# EAGLE design ControlBoardMain (EAGLE 8.1.0)
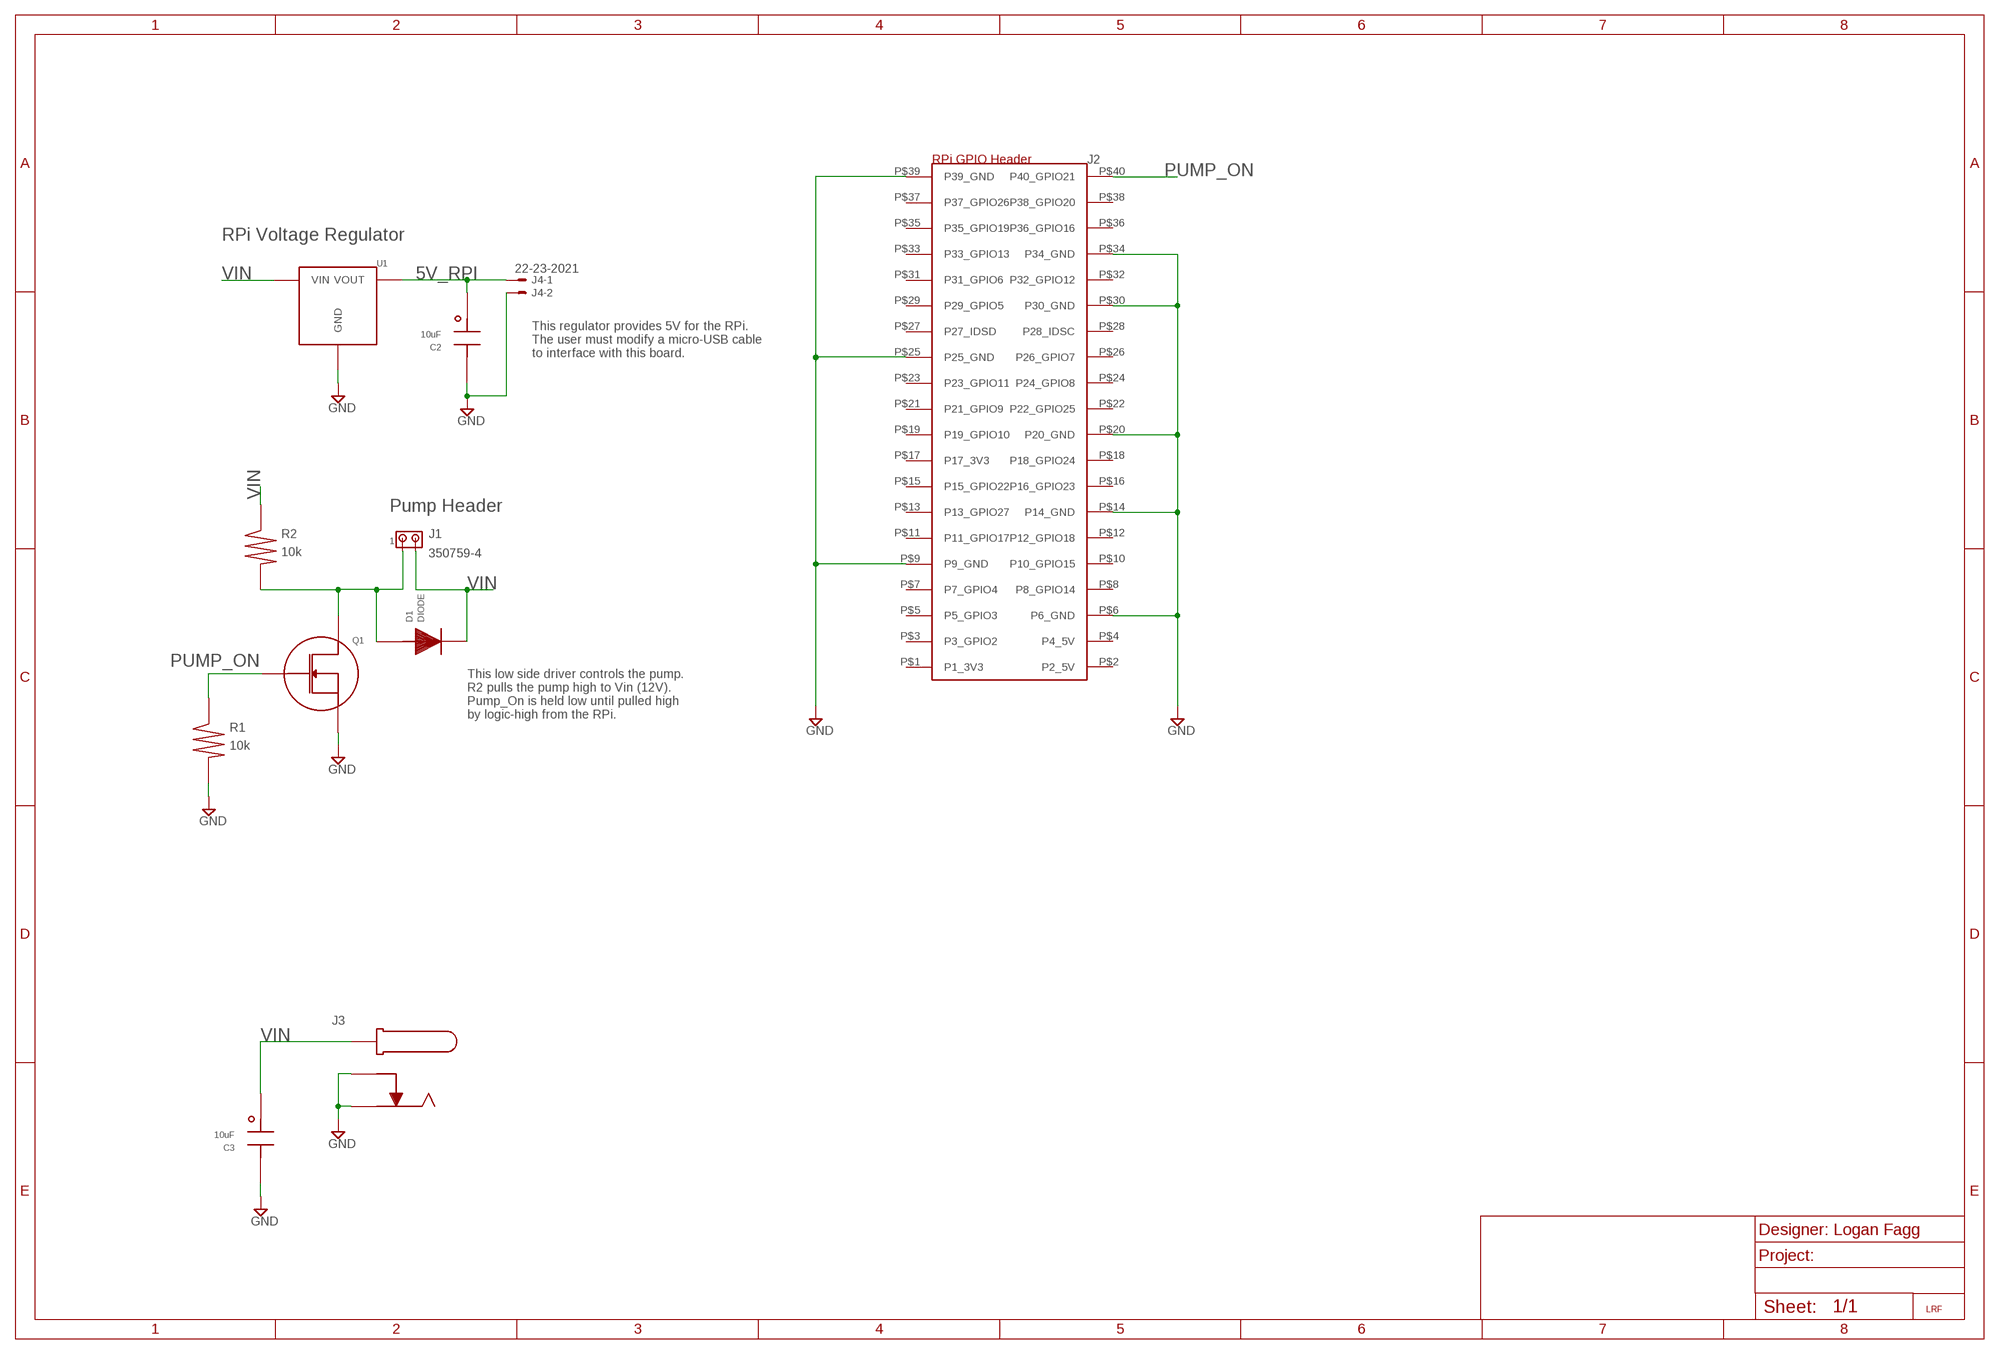
[diagram p0: schematic, sheet 1]

## Parts
C2  10uF  CAPACITOR  [TH_PASSIVE]
C3  10uF  CAPACITOR  [TH_PASSIVE]
D1  DIODE  [TH_PASSIVE]
J1  350759-4  [350759-4]
J2  RPI_HEADER  [RPIHEADER]
J3  DC_POWERJACK  [DC_POWERJACK]
J4  22-23-2021  [22-23-2021]
Q1  NMOS  [TH_3PIN]
R1  10k  RESISTOR  [TH_PASSIVE]
R2  10k  RESISTOR  [TH_PASSIVE]
U1  VOLTAGE_REGULATOR  [TH_3PIN]
U$1  LOGO  [LOGO]

## Nets
5V_RPI: C2.P1 J4.1 U1.P3(VOUT)
GND: C2.P2 C3.P2 J2.P$6(P6_GND) J2.P$9(P9_GND) J2.P$14(P14_GND) J2.P$20(P20_GND) J2.P$25(P25_GND) J2.P$30(P30_GND) J2.P$34(P34_GND) J2.P$39(P39_GND) J3.P2 J3.P3 J4.2 Q1.P3(SOURCE) R1.P2 U1.P2(GND)
PUMP_GND: D1.P2 J1.1 Q1.P2(DRAIN) R2.P2
PUMP_ON: J2.P$40(P40_GPIO21) Q1.P1(GATE) R1.P1
VIN: C3.P1 D1.P1 J1.2 J3.P1 R2.P1 U1.P1(VIN)
Unconnected: J2.P$1(P1_3V3) J2.P$2(P2_5V) J2.P$3(P3_GPIO2) J2.P$4(P4_5V) J2.P$5(P5_GPIO3) J2.P$7(P7_GPIO4) J2.P$8(P8_GPIO14) J2.P$10(P10_GPIO15) J2.P$11(P11_GPIO17) J2.P$12(P12_GPIO18) J2.P$13(P13_GPIO27) J2.P$15(P15_GPIO22) J2.P$16(P16_GPIO23) J2.P$17(P17_3V3) J2.P$18(P18_GPIO24) J2.P$19(P19_GPIO10) J2.P$21(P21_GPIO9) J2.P$22(P22_GPIO25) J2.P$23(P23_GPIO11) J2.P$24(P24_GPIO8) J2.P$26(P26_GPIO7) J2.P$27(P27_IDSD) J2.P$28(P28_IDSC) J2.P$29(P29_GPIO5) J2.P$31(P31_GPIO6) J2.P$32(P32_GPIO12) J2.P$33(P33_GPIO13) J2.P$35(P35_GPIO19) J2.P$36(P36_GPIO16) J2.P$37(P37_GPIO26) J2.P$38(P38_GPIO20)

## Notes on the sheet
- RPi Voltage Regulator
- This regulator provides 5V for the RPi.
  The user must modify a micro-USB cable
  to interface with this board.
- Pump Header
- This low side driver controls the pump.
  R2 pulls the pump high to Vin (12V).
  Pump_On is held low until pulled high
  by logic-high from the RPi.

## Library data of the parts
C2 C3 = 00_ThruHole:CAPACITOR
D1 = 00_ThruHole:DIODE
J1 = con-amp:350759-4: Universal MATE-N-LOK .250" Centerline, 600 V, 19 - 36 A max Source: http://catalog.tycoelectronics.com/ .. ENG_CD_350759_R.pdf
J2 = 00_ThruHole:RPI_HEADER
J3 = 00_ThruHole:DC_POWERJACK
J4 = con-molex:22-23-2021: .100" (2.54mm) Center Header - 2 Pin; MF: MOLEX; MPN: 22-23-2021; OC_FARNELL: 1462926; OC_NEWARK: 25C3832
Q1 = 00_ThruHole:NMOS
R1 R2 = 00_ThruHole:RESISTOR
U1 = 00_ThruHole:VOLTAGE_REGULATOR
U$1 = 1111Lib:LOGO

## Board
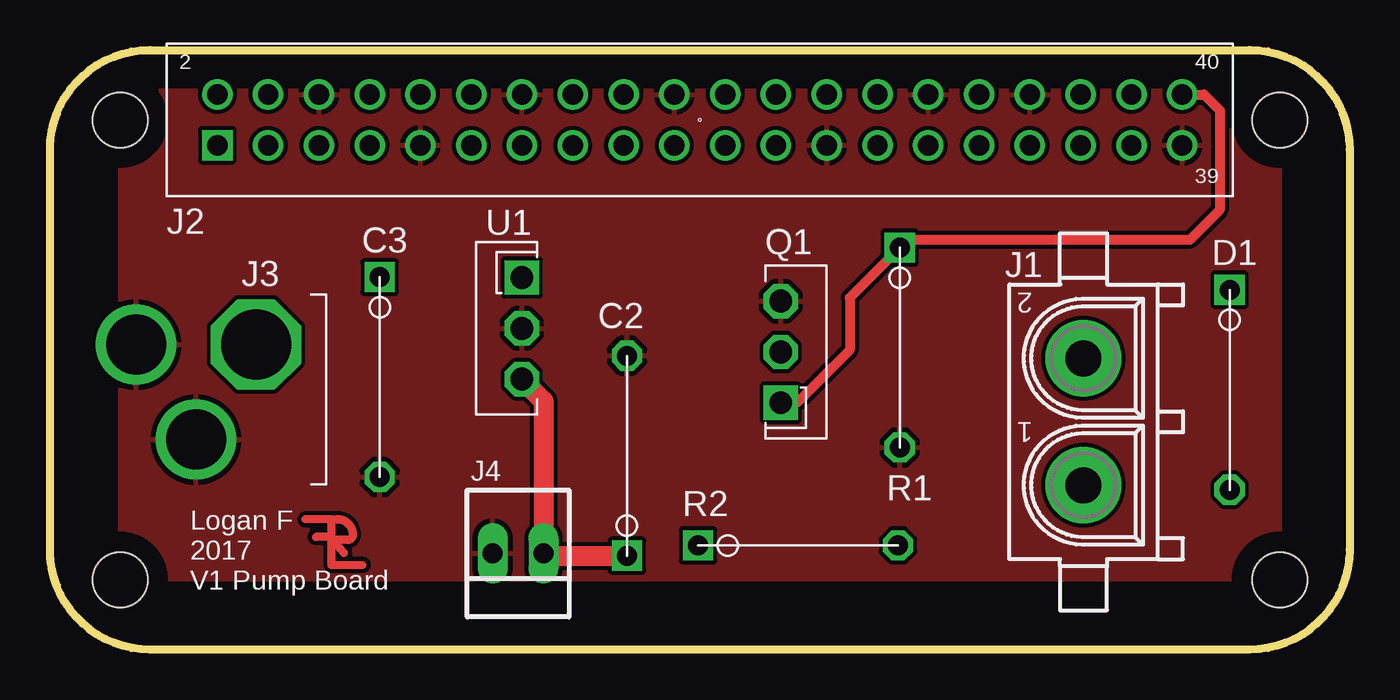
[diagram p1: board, top side]
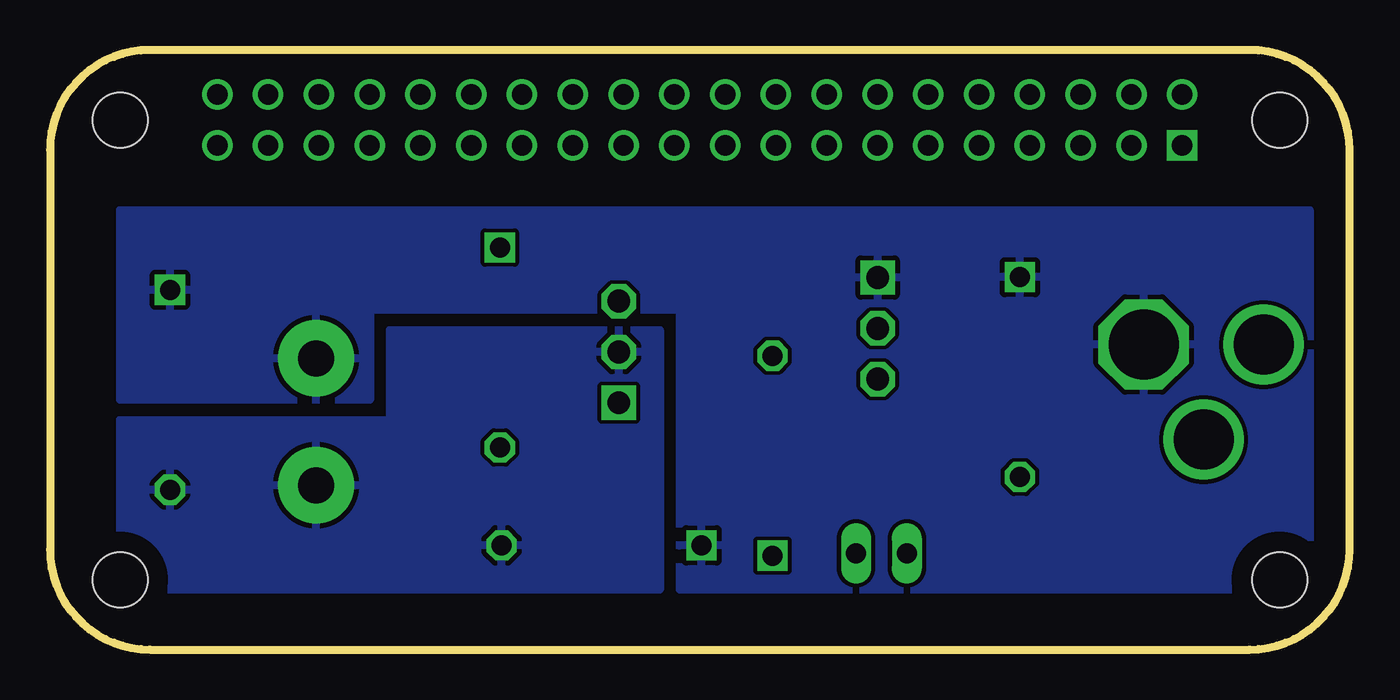
[diagram p2: board, bottom side, seen from below]

Size 65 x 30 mm. Coordinates in mm from the lower left corner, seen from the top.
Outline: 0,5 0,25 arc-90 5,30 60,30 arc-90 65,25 65,5 arc-90 60,0 5,0 arc-90 0,5
Copper layers (1*16): Top 0.035mm / dielectric 1.5mm / Bottom 0.035mm
Design rules "default": minimum track width 10mil, minimum drill 24mil, track to track 8mil, track to pad 8mil, pad to pad 8mil, via to via 8mil, smd to smd 8mil, copper to edge 40mil, drill to drill 8mil, minimum pad ring 10mil, minimum via ring 8mil, stop-mask expansion 4mil, vias tented up to drill 0mil, thermal gap 10mil
Holes 2.75 mm at 3.5,3.5 3.5,26.5 61.5,26.5 61.5,3.5

### Footprints (pad centres in the part's own frame; a part is rotated, then mirrored left to right if it is on the bottom)
TH_PASSIVE = drill 1 square: P1 0,0 | drill 1 octagon: P2 10,0
350759-4 = drill 1.8 pad 3.81: 1 -3.175,0; 2 3.175,0
RPIHEADER = drill 1.016 square: P$1 0,0 | drill 1.016: P$2 0,2.54; P$3 2.54,0; P$4 2.54,2.54; P$5 5.08,0; P$6 5.08,2.54; P$7 7.62,0; P$8 7.62,2.54; P$9 10.16,0; P$10 10.16,2.54; P$11 12.7,0; P$12 12.7,2.54; P$13 15.24,0; P$14 15.24,2.54; P$15 17.78,0; P$16 17.78,2.54; P$17 20.32,0; P$18 20.32,2.54; P$19 22.86,0; P$20 22.86,2.54; P$21 25.4,0; P$22 25.4,2.54; P$23 27.94,0; P$24 27.94,2.54; P$25 30.48,0; P$26 30.48,2.54; P$27 33.02,0; P$28 33.02,2.54; P$29 35.56,0; P$30 35.56,2.54; P$31 38.1,0; P$32 38.1,2.54; P$33 40.64,0; P$34 40.64,2.54; P$35 43.18,0; P$36 43.18,2.54; P$37 45.72,0; P$38 45.72,2.54; P$39 48.26,0; P$40 48.26,2.54
DC_POWERJACK = drill 3.5 octagon: P1 0,0 | drill 3: P2 3,4.75; P3 6,0
22-23-2021 = drill 1 long: 1 -1.27,0; 2 1.27,0
TH_3PIN = drill 1.143 square: P1 0,0 | drill 1.143 octagon: P2 2.54,0; P3 5.08,0

### Placement (x,y rotation side)
C2  28.86,4.7 90 top
C3  16.49,18.63 270 top
D1  59,18 270 top
J1  51.69,11.4 90 top
J2  8.37,25.23 0 top
J3  10.3,15.26 180 top
J4  23.41,4.81 180 top
Q1  36.55,12.35 90 top
R1  42.5,20.11 270 top
R2  32.41,5.21 0 top
U1  23.6,18.61 270 top
U$1  14.08,6.52 0 top

### Tracks (layer width: path | path; a pad name or v marks a point on that pad's centre or on a via)
5V_RPI
  Top 1: C2.P1 24.79,4.7 J4.1 24.68,12.45 U1.P3
GND
  pour Top: 3.5,28 61.5,28 61.5,3.5 3.5,3.5
PUMP_GND
  pour Bottom: 34.5,3 61.5,3 61.5,11.5 48,11.5 48,16 34.5,16
PUMP_ON
  Top 0.5: J2.P$40 57.73,27.77 58.5,27 58.5,22 57,20.5 42.89,20.5 R1.P1 40,17.61 40,15 37.35,12.35 Q1.P1
VIN
  pour Bottom: 49,12.5 61.5,12.5 61.5,22 2,22 2,3.5 2,3 33.5,3 33.5,17 49,17

### Text on the board
tPlace: Logan F / 2017 / V1 Pump Board